# EAGLE design Switched-3-Output (EAGLE 7.6.0)
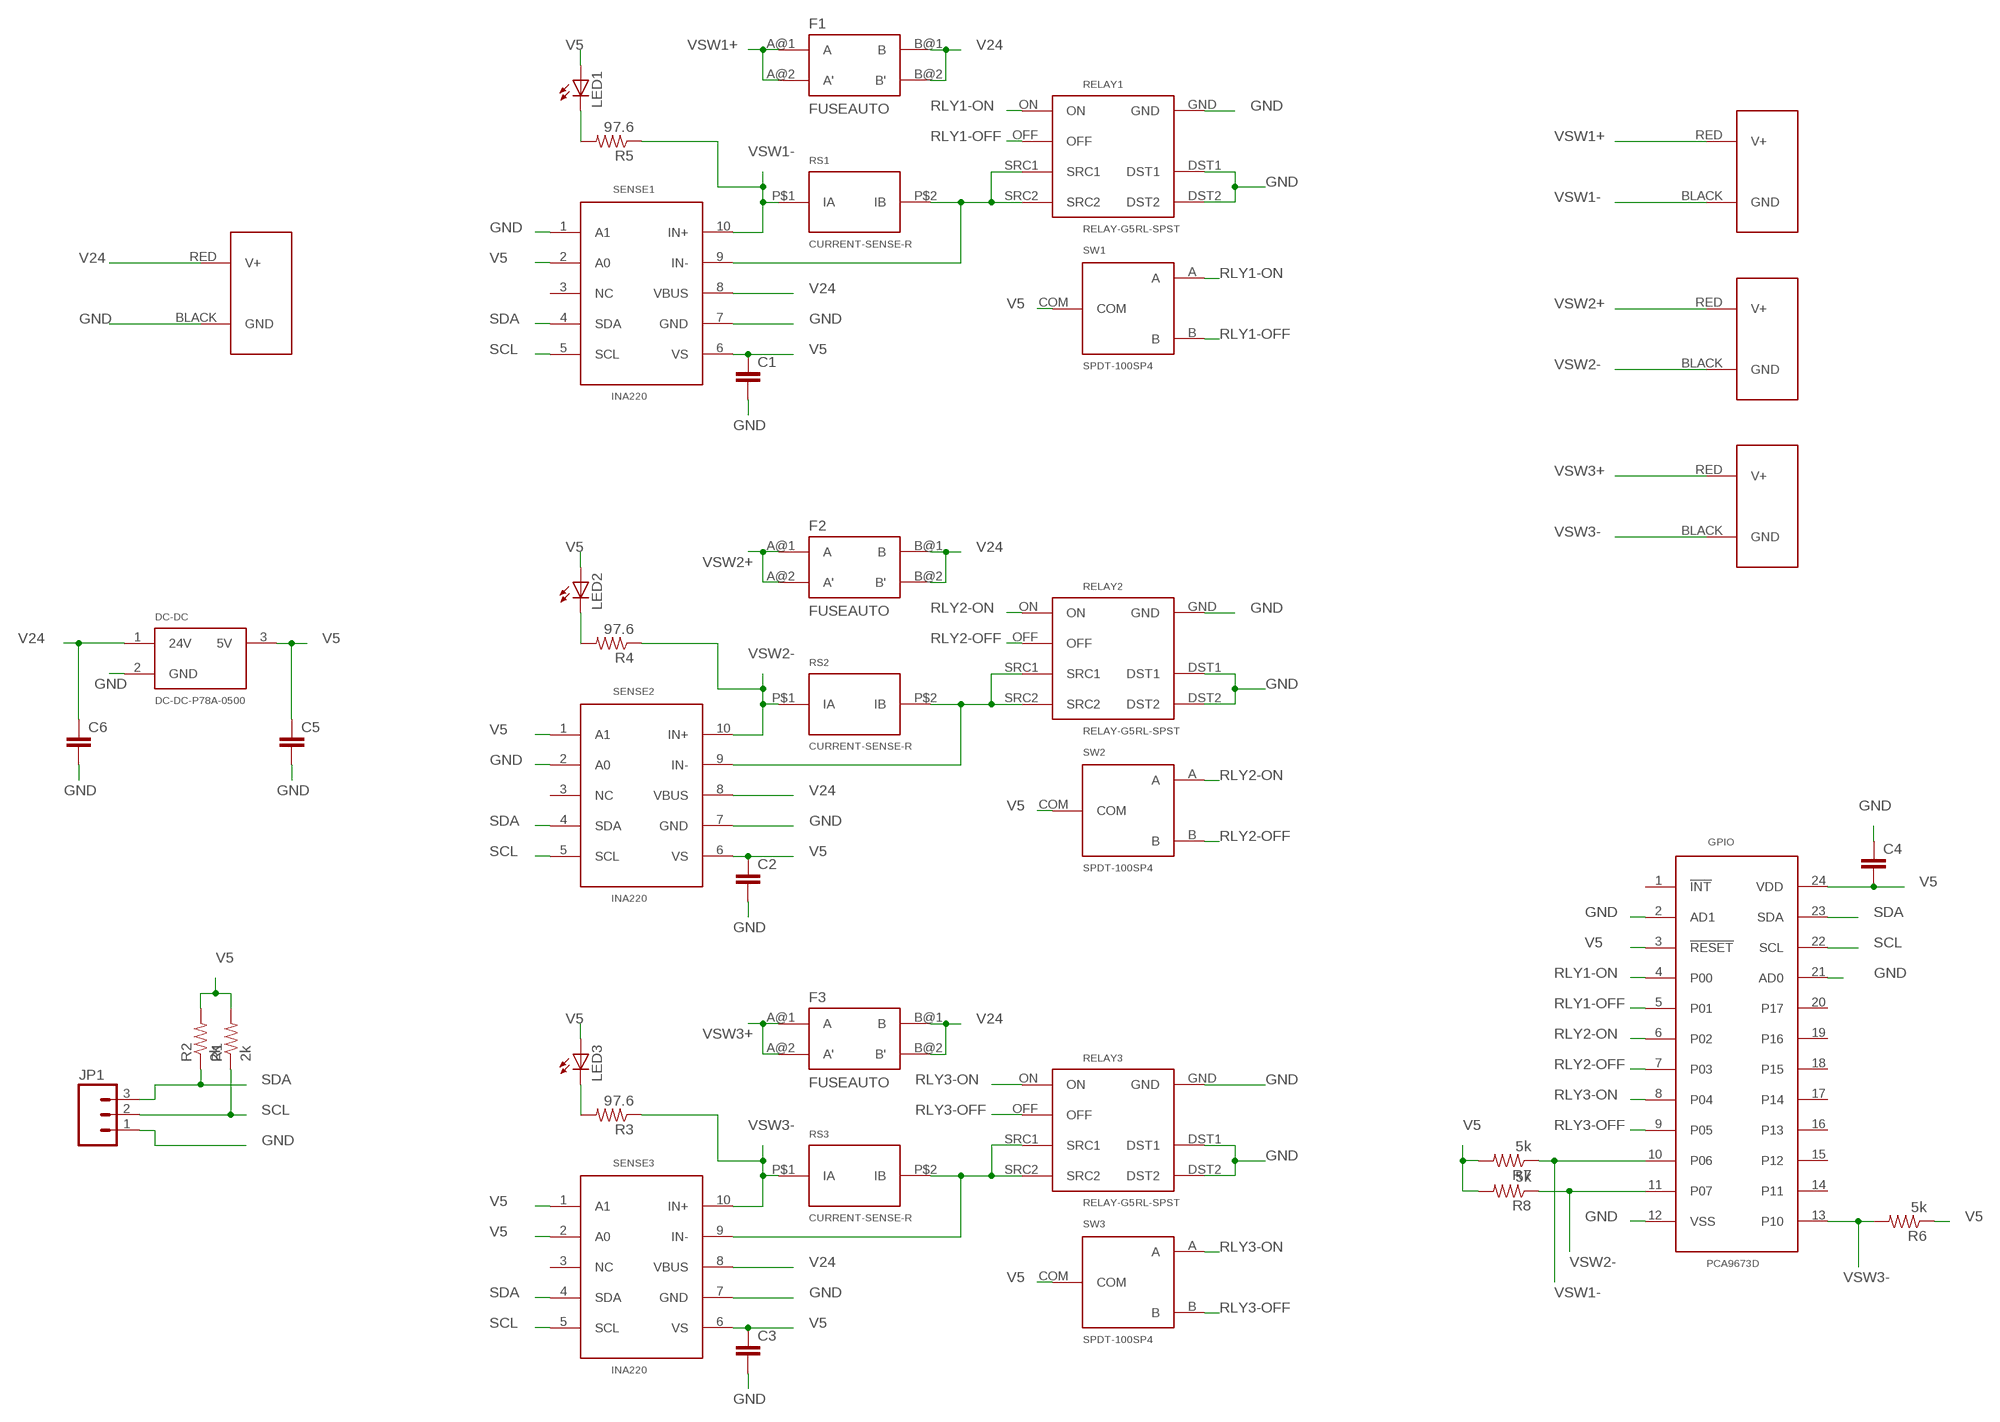
[diagram p0: schematic, sheet 1]

## Parts
C1  C-EUC0805  [C0805]
C2  C-EUC0805  [C0805]
C3  C-EUC0805  [C0805]
C4  C-EUC0805  [C0805]
C5  C-EUC0805  [C0805]
C6  C-EUC0805  [C0805]
DC-DC  DC-DC-P78A-0500  [DC-DC-P78A-0500]
F1  FUSEAUTO  [FUSE]
F2  FUSEAUTO  [FUSE]
F3  FUSEAUTO  [FUSE]
GPIO  PCA9673D  [SO24]
JP1  M03PTH  [1X03]
LED1  LED3MM  [LED3MM]
LED2  LED3MM  [LED3MM]
LED3  LED3MM  [LED3MM]
PWR  POWERPOLE_POWER45A_DRILL  [POWERPOLE_PAIR_45A_HOLE]
R1  2k  R-US_R0805  [R0805]
R2  2k  R-US_R0805  [R0805]
R3  97.6  R-US_R0805  [R0805]
R4  97.6  R-US_R0805  [R0805]
R5  97.6  R-US_R0805  [R0805]
R6  5k  R-US_R0805  [R0805]
R7  5k  R-US_R0805  [R0805]
R8  5k  R-US_R0805  [R0805]
RELAY1  RELAY-G5RL-SPST  [RELAY-G5RL-SPST]
RELAY2  RELAY-G5RL-SPST  [RELAY-G5RL-SPST]
RELAY3  RELAY-G5RL-SPST  [RELAY-G5RL-SPST]
RS1  CURRENT-SENSE-R  [CURRENT-SENSE-R]
RS2  CURRENT-SENSE-R  [CURRENT-SENSE-R]
RS3  CURRENT-SENSE-R  [CURRENT-SENSE-R]
SENSE1  INA220  [SOP-10]
SENSE2  INA220  [SOP-10]
SENSE3  INA220  [SOP-10]
SW1  SPDT-100SP4  [SPDT-100SP4]
SW2  SPDT-100SP4  [SPDT-100SP4]
SW3  SPDT-100SP4  [SPDT-100SP4]
VSW1  POWERPOLE_POWER45A_DRILL  [POWERPOLE_PAIR_45A_HOLE]
VSW2  POWERPOLE_POWER45A_DRILL  [POWERPOLE_PAIR_45A_HOLE]
VSW3  POWERPOLE_POWER45A_DRILL  [POWERPOLE_PAIR_45A_HOLE]

## Nets
GND: C1.2 C2.2 C3.2 C4.1 C5.2 C6.2 DC-DC.2(GND) GPIO.2(AD1) GPIO.12(VSS) GPIO.21(AD0) JP1.1 PWR.BLACK(GND) RELAY1.DST1 RELAY1.DST2 RELAY1.GND RELAY2.DST1 RELAY2.DST2 RELAY2.GND RELAY3.DST1 RELAY3.DST2 RELAY3.GND SENSE1.1(A1) SENSE1.7(GND) SENSE2.2(A0) SENSE2.7(GND) SENSE3.7(GND)
N$1: LED1.K(C) R5.2
N$3: RELAY1.SRC1 RELAY1.SRC2 RS1.P$2(IB) SENSE1.9(IN-)
N$6: RELAY3.SRC1 RELAY3.SRC2 RS3.P$2(IB) SENSE3.9(IN-)
N$8: LED2.K(C) R4.2
N$9: RELAY2.SRC1 RELAY2.SRC2 RS2.P$2(IB) SENSE2.9(IN-)
N$11: LED3.K(C) R3.2
RLY1-OFF: GPIO.5(P01) RELAY1.OFF SW1.B
RLY1-ON: GPIO.4(P00) RELAY1.ON SW1.A
RLY2-OFF: GPIO.7(P03) RELAY2.OFF SW2.B
RLY2-ON: GPIO.6(P02) RELAY2.ON SW2.A
RLY3-OFF: GPIO.9(P05) RELAY3.OFF SW3.B
RLY3-ON: GPIO.8(P04) RELAY3.ON SW3.A
SCL: GPIO.22(SCL) JP1.2 R1.1 SENSE1.5(SCL) SENSE2.5(SCL) SENSE3.5(SCL)
SDA: GPIO.23(SDA) JP1.3 R2.1 SENSE1.4(SDA) SENSE2.4(SDA) SENSE3.4(SDA)
V5: C1.1 C2.1 C3.1 C4.2 C5.1 DC-DC.3(5V) GPIO.3(!RESET!) GPIO.24(VDD) LED1.A LED2.A LED3.A R1.2 R2.2 R6.1 R7.2 R8.2 SENSE1.2(A0) SENSE1.6(VS) SENSE2.1(A1) SENSE2.6(VS) SENSE3.1(A1) SENSE3.2(A0) SENSE3.6(VS) SW1.COM SW2.COM SW3.COM
V24: C6.1 DC-DC.1(24V) F1.B@1(B) F1.B@2(B') F2.B@1(B) F2.B@2(B') F3.B@1(B) F3.B@2(B') PWR.RED(V+) SENSE1.8(VBUS) SENSE2.8(VBUS) SENSE3.8(VBUS)
VSW1+: F1.A@1(A) F1.A@2(A') VSW1.RED(V+)
VSW1-: GPIO.10(P06) R5.1 R7.1 RS1.P$1(IA) SENSE1.10(IN+) VSW1.BLACK(GND)
VSW2+: F2.A@1(A) F2.A@2(A') VSW2.RED(V+)
VSW2-: GPIO.11(P07) R4.1 R8.1 RS2.P$1(IA) SENSE2.10(IN+) VSW2.BLACK(GND)
VSW3+: F3.A@1(A) F3.A@2(A') VSW3.RED(V+)
VSW3-: GPIO.13(P10) R3.1 R6.2 RS3.P$1(IA) SENSE3.10(IN+) VSW3.BLACK(GND)
Unconnected: GPIO.1(!INT!) GPIO.14(P11) GPIO.15(P12) GPIO.16(P13) GPIO.17(P14) GPIO.18(P15) GPIO.19(P16) GPIO.20(P17) SENSE1.3(NC) SENSE2.3(NC) SENSE3.3(NC)

## Library data of the parts
C1-C6 = resistor:C-EU: CAPACITOR, European symbol
DC-DC = GARTH:DC-DC-P78A-0500
F1-F3 = GARTH:FUSE: This is a fuse holder for standard automotive fuses. Data sheet is : http://www.mouser.com/ds/2/215/557-15-961421.pdf
GPIO = GARTH:PCA9673: 16-bit I/O expander with i2c. Datasheet : http://www.mouser.com/ds/2/302/PCA9673-841965.pdf
JP1 = SparkFun:M03: Header 3 Standard 3-pin 0.1" header. Use with straight break away headers (SKU : PRT-00116), right angle break away headers (PRT-00553), swiss pins (PRT-00743), machine pins (PRT-00117), and female headers (PRT-00115). Molex polarized connector foot print use with SKU : PRT-08232 with associated crimp pins and housings.
LED1-LED3 = SparkFun:LED: LEDs Standard schematic elements and footprints for 5mm, 3mm, 1206, and 0603 sized LEDs. 5mm - Spark Fun Electronics SKU : COM-00529 (and others)
PWR VSW1-VSW3 = powerpoles:POWERPOLE_POWER: Anderson Powerpole Power Connector using ameteur radio standard layout
R1-R8 = resistor:R-US_: RESISTOR, American symbol
RELAY1-RELAY3 = GARTH:RELAY-G5RL-SPST: High power SPST Relay. Datasheet : http://www.mouser.com/ds/2/307/en-g5rl-531959.pdf
RS1-RS3 = GARTH:CURRENT-SENSE-R
SENSE1-SENSE3 = GARTH:INA220: Current monitor. Datasheet : http://www.ti.com/lit/ds/symlink/ina220.pdf
SW1-SW3 = GARTH:SPDT-100SP4: An SPDT (ON)-OFF-(ON) microswitch. Datasheet http://www.mouser.com/ds/2/140/100-346274.pdf

## Board
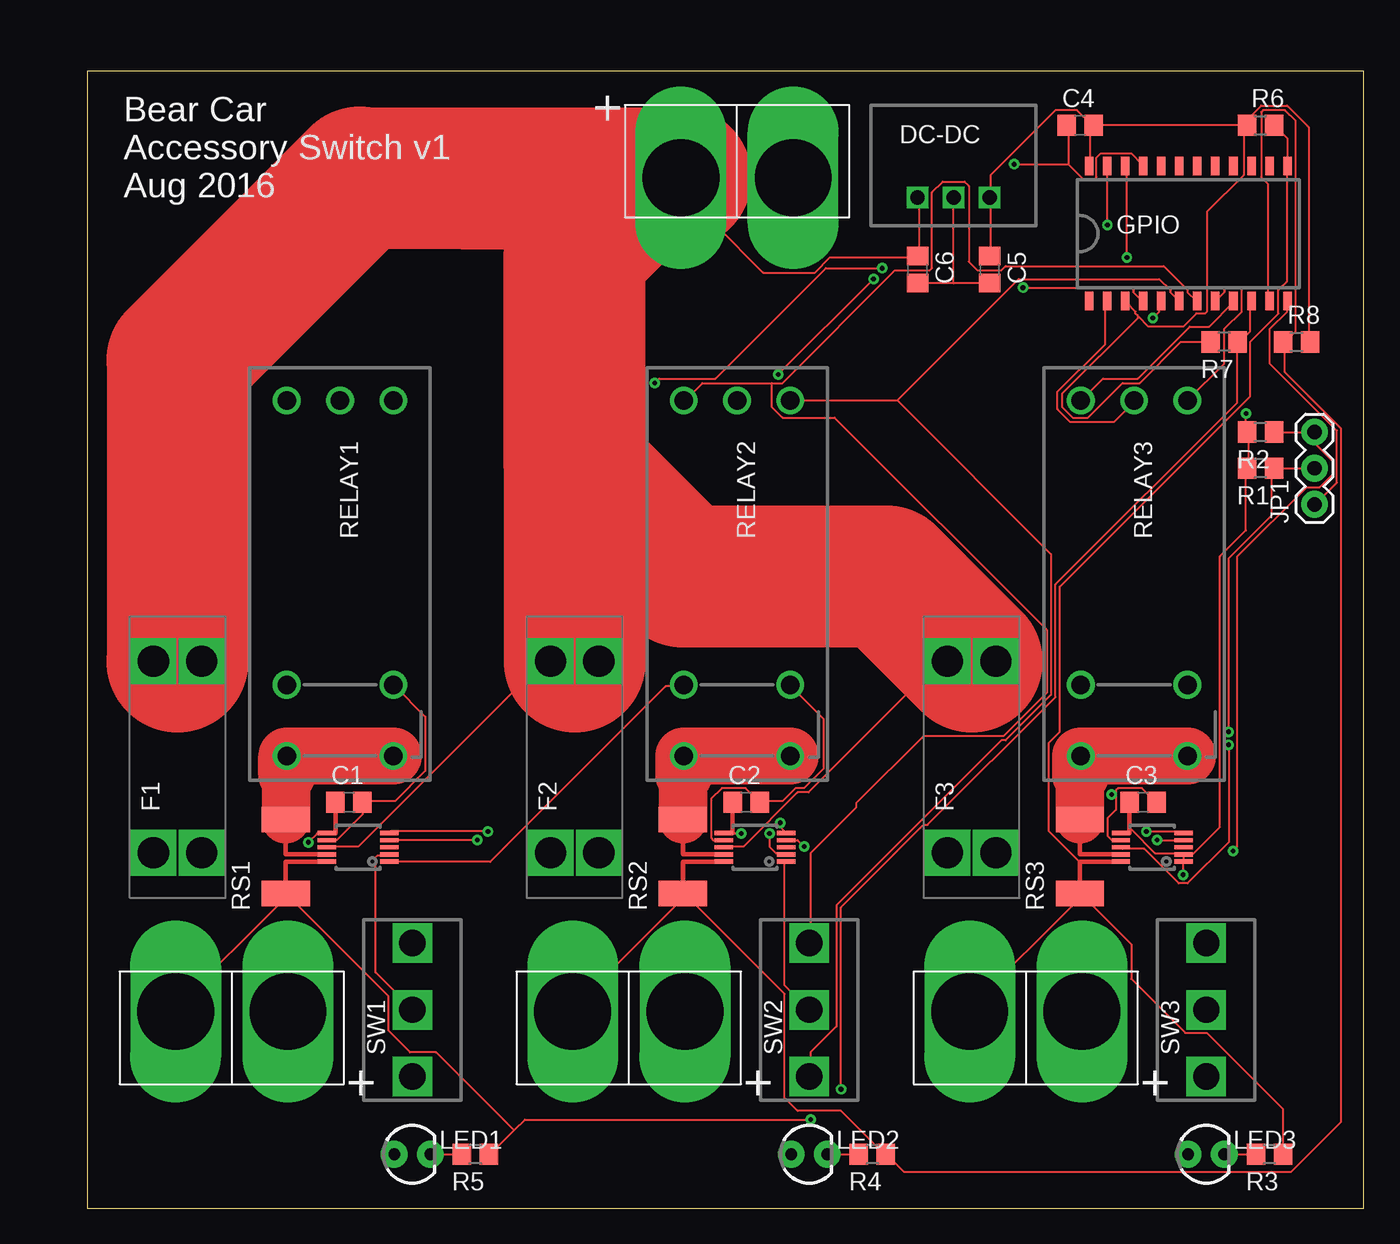
[diagram p1: board, top side]
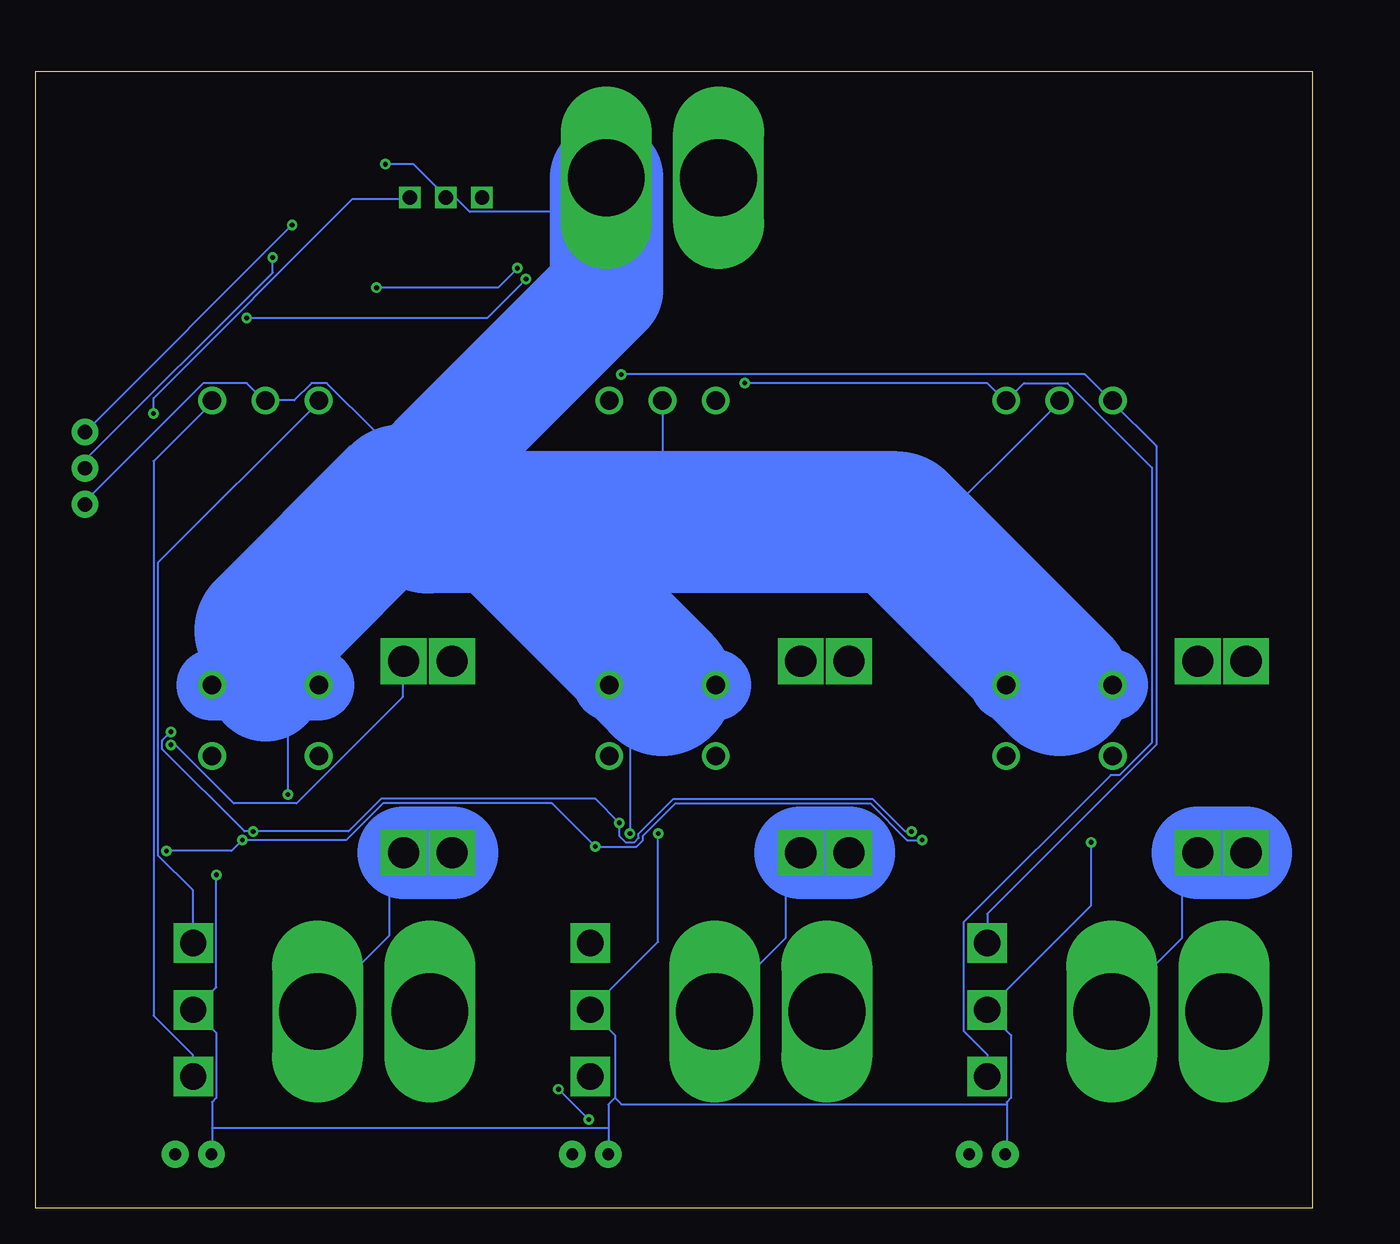
[diagram p2: board, bottom side, seen from below]

Size 89.84 x 80 mm. Coordinates in mm from the lower left corner, seen from the top.
Outline: 0,0 89.84,0 89.84,80 0,80 0,0
Copper layers (1*16): Top 0.035mm / dielectric 1.5mm / Bottom 0.035mm
Design rules "default *": minimum track width 6mil, minimum drill 13mil, track to track 6mil, track to pad 6mil, pad to pad 6mil, via to via 6mil, smd to smd 6mil, copper to edge 40mil, drill to drill 8mil, minimum pad ring 10mil, minimum via ring 8mil, stop-mask expansion 4mil, vias tented up to drill 0mil, thermal gap 10mil

### Footprints (pad centres in the part's own frame; a part is rotated, then mirrored left to right if it is on the bottom)
C0805 = smd 1.3 x 1.5: 1 -0.95,0; 2 0.95,0
DC-DC-P78A-0500 = drill 1 square: 1 -2.54,0; 2 0,0; 3 2.54,0
FUSE = drill 2.2 square: A@1 -6.735,1.7; A@2 -6.735,-1.7; B@1 6.735,1.7; B@2 6.735,-1.7
SO24 = smd 0.6 x 1.3: 1 -6.985,-4.75; 2 -5.715,-4.75; 3 -4.445,-4.75; 4 -3.175,-4.75; 5 -1.905,-4.75; 6 -0.635,-4.75; 7 0.635,-4.75; 8 1.905,-4.75; 9 3.175,-4.75; 10 4.445,-4.75; 11 5.715,-4.75; 12 6.985,-4.75; 13 6.985,4.75; 14 5.715,4.75; 15 4.445,4.75; 16 3.175,4.75; 17 1.905,4.75; 18 0.635,4.75; 19 -0.635,4.75; 20 -1.905,4.75; 21 -3.175,4.75; 22 -4.445,4.75; 23 -5.715,4.75; 24 -6.985,4.75
1X03 = drill 1.016 pad 1.88: 1 0,0; 2 2.54,0; 3 5.08,0
LED3MM = drill 0.813 pad 1.88: A -1.27,0; K 1.27,0
POWERPOLE_PAIR_45A_HOLE = drill 5.4 long: BLACK 3.95,-1.15; RED -3.95,-1.15
R0805 = smd 1.3 x 1.5: 1 -0.95,0; 2 0.95,0
RELAY-G5RL-SPST = drill 1.3: DST1 8.25,3.75; DST2 8.25,-3.75; GND -11.75,0; OFF -11.75,-3.75; ON -11.75,3.75; SRC1 13.25,3.75; SRC2 13.25,-3.75
CURRENT-SENSE-R = smd 1.8 x 3.4: P$1 -2.6,0; P$2 2.6,0
SOP-10 = smd 0.3 x 1.3: 1 -1,-2.2; 2 -0.5,-2.2; 3 0,-2.2; 4 0.5,-2.2; 5 1,-2.2; 6 1,2.2; 7 0.5,2.2; 8 0,2.2; 9 -0.5,2.2; 10 -1,2.2
SPDT-100SP4 = drill 1.85 square: A -4.7,0; B 4.7,0; COM 0,0

### Placement (x,y rotation side)
C1  18.41,28.57 0 top
C2  46.35,28.57 0 top
C3  74.3,28.57 0 top
C4  69.85,76.2 0 top
C5  63.5,66.04 270 top
C6  58.42,66.04 270 top
DC-DC  60.96,71.12 0 top
F1  6.35,31.75 90 top
F2  34.29,31.75 90 top
F3  62.23,31.75 90 top
GPIO  77.47,68.58 0 top
JP1  86.36,49.53 90 top
LED1  22.86,3.81 0 top
LED2  50.8,3.81 0 top
LED3  78.74,3.81 0 top
PWR  45.72,73.66 0 top
R1  82.55,52.07 180 top
R2  82.55,54.61 180 top
R3  83.19,3.81 180 top
R4  55.24,3.81 180 top
R5  27.3,3.81 180 top
R6  82.55,76.2 0 top
R7  80.01,60.96 180 top
R8  85.09,60.96 0 top
RELAY1  17.78,45.09 270 top
RELAY2  45.72,45.09 270 top
RELAY3  73.66,45.09 270 top
RS1  13.97,24.77 90 top
RS2  41.91,24.77 90 top
RS3  69.85,24.77 90 top
SENSE1  19.05,25.4 90 top
SENSE2  46.99,25.4 90 top
SENSE3  74.93,25.4 90 top
SW1  22.86,13.97 90 top
SW2  50.8,13.97 90 top
SW3  78.74,13.97 90 top
VSW1  10.16,12.7 180 top
VSW2  38.1,12.7 180 top
VSW3  66.04,12.7 180 top

### Tracks (layer width: path | path; a pad name or v marks a point on that pad's centre or on a via)
GND  (via drill 0.33)
  Top 0.152: 69.04,73.46 70.1,72.39 70.87,72.39 71.02,72.54 71.02,73.91 71.32,74.22 73.46,74.22 74.22,73.46 GPIO.21 | 69.04,73.46 69.04,76.2 C4.1 | 60.96,65.08 63.4,65.08 C5.2 | 60.96,65.08 58.52,65.08 C6.2 | 60.96,65.08 DC-DC.2 | v65.23,73.46 69.04,73.46 | GPIO.12 84.43,63.7 84.43,63.09 83.21,61.87 83.21,59.44 87.94,54.71 87.94,51.05 86.41,49.53 JP1.1 | GPIO.2 71.63,63.7 71.63,60.81 68.28,57.45 68.28,56.24 69.19,55.32 72.24,55.32 73.61,56.69 RELAY3.GND | 72.39,29.11 72.39,29.41 72.54,29.57 74.22,29.57 75.13,28.65 C3.2 | 72.39,29.11 72.39,28.04 71.78,27.43 71.78,26.21 72.08,25.91 72.69,25.91 SENSE3.7 | SENSE2.7 44.65,25.91 44.04,25.91 43.89,26.06 43.89,28.8 44.65,29.57 46.33,29.57 47.24,28.65 C2.2 47.4,28.65 48.92,28.65 49.84,29.57 50.44,29.57 51.82,30.94 51.82,34.44 49.53,36.73 RELAY2.DST1 | SENSE1.7 16.92,25.91 17.53,25.91 19.36,27.74 19.36,28.5 C1.2 19.51,28.65 21.64,28.65 23.77,30.79 23.77,34.59 21.64,36.73 RELAY1.DST1 | SENSE1.1 21.34,24.38 28.35,24.38 40.69,36.73 41.91,36.73 RELAY2.DST2 | v48.01,26.36 48.01,25.45 48.46,24.99 49.07,24.99 SENSE2.2 | v72.08,29.11 72.39,29.11
  Bottom 0.152: v65.23,73.46 63.25,73.46 60.96,71.17 DC-DC.2 60.96,71.02 60.2,71.02 59.28,70.1 49.67,70.1 | v48.01,26.36 48.01,32.46 45.72,36.84 | v72.08,29.11 72.08,33.22 73.66,36.84 | 27.74,46.79 17.83,56.69 RELAY1.GND | RELAY2.GND 45.72,48.26 | 64.14,50.16 65.99,54.71 69.34,58.06 70.41,58.06 71.63,56.84 73.61,56.84 RELAY3.GND 73.76,56.84 74.98,58.06 78.03,58.06 86.26,49.84 86.26,49.53 JP1.1
  Bottom 10: 73.66,40.64 64.14,50.16 | 25.43,44.48 17.78,36.84 | 25.43,44.48 27.74,46.79 29.21,48.26 45.72,48.26 62.23,48.26 | 57.84,48.96 45.72,36.84
  Bottom 5: RELAY1.DST2 17.78,36.84 RELAY1.DST1 | RELAY2.DST2 45.72,36.84 RELAY2.DST1 | RELAY3.DST1 73.66,36.84 RELAY3.DST2
  Bottom 6: 61.59,52.7 61.59,48.96 57.84,48.96 | 25.43,44.48 | 62.23,48.26 64.14,50.16
  Bottom 8: 64.14,50.16 61.59,52.7 49.67,64.63 49.67,70.1 PWR.BLACK | 73.66,40.64 73.66,36.84
N$1
  Top 0.152: LED1.K R5.2
N$3
  Top 0.3: SENSE1.9 13.97,24.9 RS1.P$2
  Top 0.406: RS1.P$2 13.97,27.94 | 13.97,30.48 14.03,30.48
  Top 3.4: RS1.P$2 arc1 13.97,30.48
  Top 4: 14.03,30.48 RELAY1.SRC2 RELAY1.SRC1
N$6
  Top 0.3: SENSE3.9 69.85,24.9 RS3.P$2
  Top 0.406: 69.85,30.48 69.91,30.48
  Top 3.4: RS3.P$2 arc1 69.85,30.48
  Top 4: 69.91,30.48 RELAY3.SRC2 RELAY3.SRC1
N$8
  Top 0.152: LED2.K R4.2
N$9
  Top 0.3: SENSE2.9 41.91,24.9 RS2.P$2
  Top 0.406: 41.91,30.48 41.97,30.48
  Top 3.4: RS2.P$2 arc1 41.91,30.48
  Top 4: 41.97,30.48 RELAY2.SRC2 RELAY2.SRC1
N$11
  Top 0.152: LED3.K R3.2
RLY1-OFF  (via drill 0.33)
  Top 0.152: v74.98,62.64 75.44,63.09 75.44,63.7 GPIO.5 | v48.62,58.67 v55.32,65.38
  Bottom 0.152: v74.98,62.64 58.06,62.64 v55.32,65.38 | v48.62,58.67 16,58.67 14.17,56.84 RELAY1.OFF 14.02,56.69 10.97,53.65 10.97,32.61 22.86,20.73 SW1.B
RLY1-ON  (via drill 0.33)
  Top 0.152: v65.84,64.77 73.46,64.77 73.61,64.62 73.61,64.47 74.22,63.86 GPIO.4 | v55.93,66.14 51.97,66.14 44.2,58.37 40.23,58.37 v39.93,58.06
  Bottom 0.152: v65.84,64.77 57.3,64.77 v55.93,66.14 | v39.93,58.06 22.86,58.06 21.64,56.84 RELAY1.ON 21.49,56.84 20.27,58.06 17.22,58.06 11.28,52.12 11.28,32.77 13.56,30.48 14.17,30.48 24.54,20.12 24.54,12.5 22.86,10.82 SW1.A
RLY2-OFF
  Top 0.152: 48.16,58.06 43.28,58.06 42.06,56.84 RELAY2.OFF | 48.16,58.06 48.92,58.06 56.84,65.99 59.28,65.99 59.44,66.14 59.44,71.48 60.2,72.24 61.72,72.24 62.03,71.93 62.03,66.6 62.64,65.99 64.31,65.99 64.62,66.29 75.74,66.29 77.42,64.62 77.42,64.47 78.03,63.86 GPIO.7 | 48.16,58.06 48.16,56.39 48.92,55.63 52.58,55.63 67.51,40.69 67.51,36.27 64.47,33.22 58.83,33.22 54.1,28.5 54.1,28.19 50.9,24.99 50.9,18.75 SW2.B
RLY2-ON
  Top 0.152: 57,56.84 65.53,65.38 75.44,65.38 76.2,64.62 76.2,64.47 76.81,63.86 GPIO.6 | 57,56.84 49.53,56.84 RELAY2.ON | 57,56.84 67.82,46.02 67.82,36.12 64.62,32.92 64.31,32.92 52.73,21.34 52.73,12.8 50.9,10.97 50.9,9.3 SW2.A
RLY3-OFF
  Top 0.152: GPIO.9 80.62,63.7 78.94,62.03 77.57,62.03 73.91,58.37 71.48,58.37 69.95,56.84 RELAY3.OFF
  Bottom 0.152: SW3.B 78.79,18.75 78.79,22.4 81.23,24.84 81.23,45.41 69.95,56.69 RELAY3.OFF
RLY3-ON
  Top 0.152: GPIO.8 79.4,63.86 80.01,64.47 80.01,64.62 80.16,64.77 81.08,64.77 81.23,64.62 81.23,63.09 80.01,61.87 80.01,59.44 RELAY3.ON
  Bottom 0.152: SW3.A 78.79,9.3 78.79,10.82 81.53,13.56 81.53,52.58 77.42,56.69 RELAY3.ON
SCL  (via drill 0.33)
  Top 0.152: v73.15,66.9 73.15,73.3 GPIO.22 | v28.19,26.52 21.34,26.52 SENSE1.5 | v48.77,27.13 48.77,26.82 49.07,26.52 SENSE2.5 | v74.52,26.52 77.11,26.52 SENSE3.5 | v80.31,33.53 80.31,45.72 83.36,48.77 83.36,51.97 R1.1
  Top 0.155: R1.1 JP1.2
  Bottom 0.152: v73.15,66.9 73.15,65.84 86.26,52.73 86.26,52.12 JP1.2 | v28.19,26.52 28.65,26.52 30.94,28.8 44.96,28.8 47.4,26.36 47.4,26.06 47.7,25.76 48.31,25.76 48.77,26.21 v48.77,27.13 50.44,28.8 65.53,28.8 67.82,26.52 v74.52,26.52 75.13,26.52 80.92,32.31 80.92,32.92 v80.31,33.53
SDA  (via drill 0.33)
  Top 0.152: v71.78,69.19 71.78,73.3 GPIO.23 | v27.43,25.91 21.34,25.91 SENSE1.4 | v50.44,25.45 49.99,25.91 49.23,25.91 SENSE2.4 | v75.29,25.91 77.11,25.91 SENSE3.4 | v80.62,25.15 80.92,25.45 80.92,45.87 85.8,50.75 86.72,50.75 87.63,51.66 87.63,52.58 86.41,53.8 86.41,54.56 JP1.3
  Top 0.155: R2.1 JP1.3
  Bottom 0.152: JP1.3 v71.78,69.19 | v27.43,25.91 28.5,25.91 31.09,28.5 44.81,28.5 47.09,26.21 47.09,25.91 47.55,25.45 v50.44,25.45 53.49,28.5 65.38,28.5 67.97,25.91 v75.29,25.91 76.05,25.15 v80.62,25.15
V5  (via drill 0.33)
  Top 0.152: C5.1 63.55,67.06 63.55,71.02 DC-DC.3 63.55,71.17 63.55,72.69 68.12,77.27 69.65,77.27 70.71,76.2 | 70.71,76.2 70.56,76.05 70.56,73.46 GPIO.24 | 73.91,62.79 74.68,62.03 77.11,62.03 78.03,62.94 78.64,62.94 78.79,63.09 78.79,70.1 81.38,72.69 81.38,76.05 81.53,76.2 | 73.91,62.79 73.76,62.94 73.76,63.09 73.15,63.7 GPIO.3 | R7.2 76.96,60.96 74.07,58.06 72.85,58.06 70.41,55.63 69.34,55.63 68.58,56.39 68.58,57.3 73.91,62.64 73.91,62.79 | R8.2 85.95,60.96 85.95,76.05 84.43,77.57 82.6,77.57 81.69,76.66 81.69,76.2 R6.1 81.53,76.2 | 81.53,76.2 C4.2 70.71,76.2 | SENSE3.2 77.11,24.84 77.11,24.54 SENSE3.1 77.11,24.38 v77.11,23.47 | SENSE3.2 77.11,24.99 75.13,24.99 73.46,26.67 73.34,26.67 | SENSE3.2 77.27,24.99 77.88,24.99 79.7,26.82 79.7,45.87 81.53,47.7 81.53,51.97 R1.2 81.69,52.12 81.69,54.56 R2.2 81.53,54.71 v81.53,55.93 | SENSE1.2 21.18,24.84 20.42,24.84 20.27,24.69 20.27,16.61 22.86,14.02 SW1.COM | v15.54,25.76 16.15,26.36 16.76,26.36 SENSE1.6 | SW2.COM 49.07,15.7 49.07,24.38 SENSE2.1 | v46.02,26.36 45.41,26.36 SENSE2.6
  Top 0.3: SENSE1.6 17.46,26.4 C1.1 | SENSE2.6 45.41,26.4 C2.1 | SENSE3.6 73.34,26.4 73.34,26.67 C3.1
  Bottom 0.152: v15.54,25.76 15.54,21.34 22.86,14.02 SW1.COM 22.86,13.87 21.18,12.19 21.18,7.77 21.49,7.47 21.49,7.32 | 21.49,7.32 21.49,3.81 LED1.A | 77.42,5.64 77.42,7.47 77.11,7.77 77.11,12.34 SW3.COM 78.64,14.02 77.11,15.54 v77.11,23.47 | 77.42,5.64 77.42,3.81 LED3.A | v46.02,26.36 46.02,18.75 SW2.COM 50.75,13.87 49.07,12.19 49.07,7.77 | 49.53,5.64 49.53,7.32 49.07,7.77 | 49.53,5.64 LED2.A | 49.53,5.64 77.42,5.64 | 21.49,7.32 48.62,7.32 49.07,7.77 | v81.53,55.93 81.53,57 67.51,71.02 63.55,71.02 DC-DC.3
V24  (via drill 0.33)
  Top 0.152: DC-DC.1 58.52,71.02 58.52,67.06 C6.1 58.37,66.9 52.27,66.9 51.21,65.84 47.55,65.84 44.2,69.19 PWR.RED | SENSE1.8 16.92,25.45 19.05,25.45 29.87,36.27 34.29,38.48 | 61.1,39.61 50.75,29.26 49.99,29.26 46.18,25.45 44.81,25.45 SENSE2.8 | v80.31,32.61 80.31,25.76 77.42,22.86 76.81,22.86 74.37,25.3 72.85,25.3 SENSE3.8
  Top 10: 34.29,52.07 34.29,67.31 39.37,72.39 | 34.29,52.07 41.91,44.45 56.27,44.45 61.1,39.61 62.23,38.48 | PWR.RED arc-1 19.17,72.51 6.35,59.69 6.35,38.48 | 34.29,52.07 34.29,38.48
  Top 6: 41.77,70.98 PWR.RED 41.65,72.39 39.37,72.39
  Top 6.5: F3.B@2 62.23,38.48 F3.B@1 | F2.B@2 34.29,38.48 F2.B@1 | F1.B@2 6.35,38.48 F1.B@1
  Bottom 0.152: v80.31,32.61 80.01,32.61 75.89,28.5 71.48,28.5 64.01,35.97 64.01,38.41 F3.B@2
VSW1+
  Bottom 0.152: F1.A@2 9.14,21.95 9.14,19.05 14.02,14.17 14.02,13.87 VSW1.RED
  Bottom 6.5: F1.A@2 F1.A@1
VSW1-  (via drill 0.33)
  Top 0.152: GPIO.10 81.84,63.7 81.84,61.72 81.08,60.96 R7.1 80.92,60.96 80.92,56.69 68.12,43.89 68.12,35.97 59.13,26.98 58.83,26.98 53.03,21.18 v53.03,8.38 | v50.9,6.25 30.79,6.25 30.02,5.49 | 30.02,5.49 28.35,3.81 R5.1 | VSW1.BLACK 6.25,13.87 6.25,14.17 13.87,21.79 13.87,22.1 RS1.P$1 14.02,22.1 21.18,14.94 21.18,12.5 22.71,10.97 24.54,10.97 30.02,5.49
  Top 0.3: SENSE1.10 13.97,24.4 RS1.P$1
  Top 0.406: 14.11,22.8 RS1.P$1
  Bottom 0.152: v50.9,6.25 v53.03,8.38
VSW2+
  Bottom 0.152: F2.A@2 37.03,21.95 37.03,19.05 41.91,14.17 41.91,13.87 VSW2.RED
  Bottom 0.406: F2.A@1 34.15,25.02
  Bottom 6.5: F2.A@2 F2.A@1
VSW2-
  Top 0.152: 84.28,60.96 85.04,61.72 85.04,76.5 84.28,77.27 82.75,77.27 82.6,77.11 82.6,72.54 83.06,72.08 83.06,63.86 GPIO.11 | 84.28,60.96 84.28,58.83 88.24,54.86 88.24,6.1 84.73,2.59 57.45,2.59 56.24,3.81 R4.1 56.08,3.81 53.03,6.86 49.99,6.86 49.07,7.77 49.07,15.09 42.06,22.1 RS2.P$1 41.76,22.1 41.76,21.64 34.29,14.17 34.29,13.87 VSW2.BLACK | 84.28,60.96 R8.1
  Top 0.3: SENSE2.10 41.91,24.4 RS2.P$1
  Top 0.406: 42.05,22.8 RS2.P$1
VSW3+
  Bottom 0.152: F3.A@2 64.92,21.95 64.92,19.2 69.95,14.17 69.95,13.87 VSW3.RED
  Bottom 0.406: F3.A@1 62.09,25.02
  Bottom 6.5: F3.A@2 F3.A@1
VSW3-
  Top 0.152: R6.2 83.52,76.2 84.43,75.29 84.43,73.46 GPIO.13 84.43,73.3 84.43,65.23 83.82,64.62 83.82,62.94 81.84,60.96 81.84,57.15 68.43,43.74 68.43,33.53 67.67,32.77 67.67,26.52 69.8,24.38 69.85,24.38 | R3.1 84.12,3.81 84.12,7.01 78.79,12.34 77.27,12.34 73.46,16.15 73.46,18.59 69.95,22.1 RS3.P$1 69.8,22.1 69.8,21.79 62.18,14.17 62.18,13.87 VSW3.BLACK
  Top 0.3: SENSE3.10 69.85,24.4 69.85,24.38 RS3.P$1
  Top 0.406: 69.99,22.8 RS3.P$1

### Text on the board
tPlace: Bear Car / Accessory Switch v1 / Aug 2016
tDocu: Switched 1 | Switched 2 | Switched 3